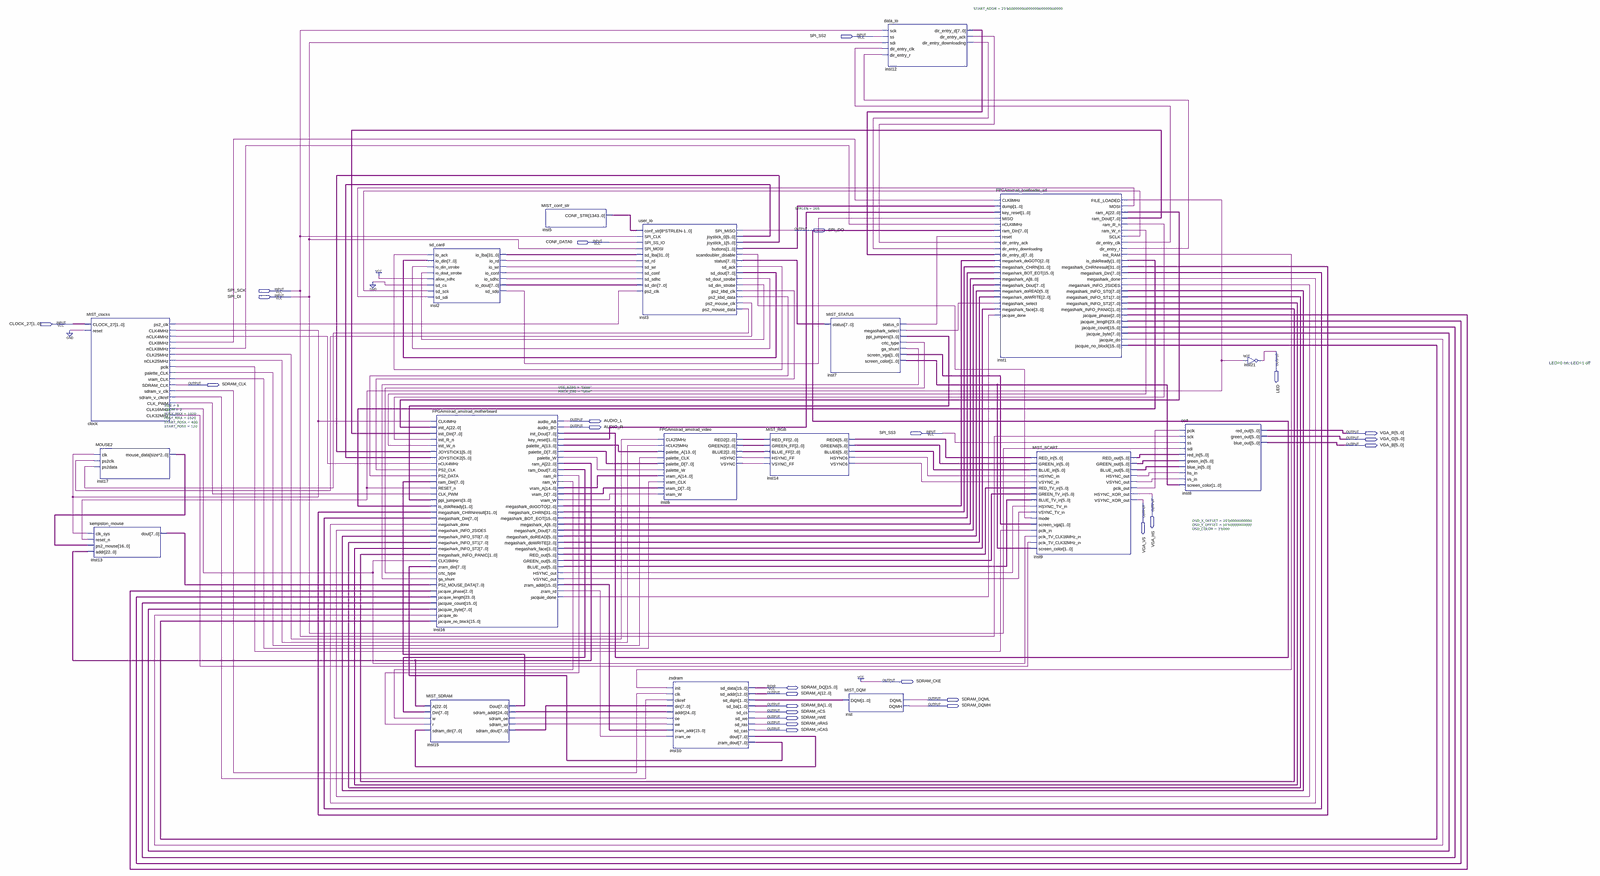
[diagram p0: schematic sheet, whole]
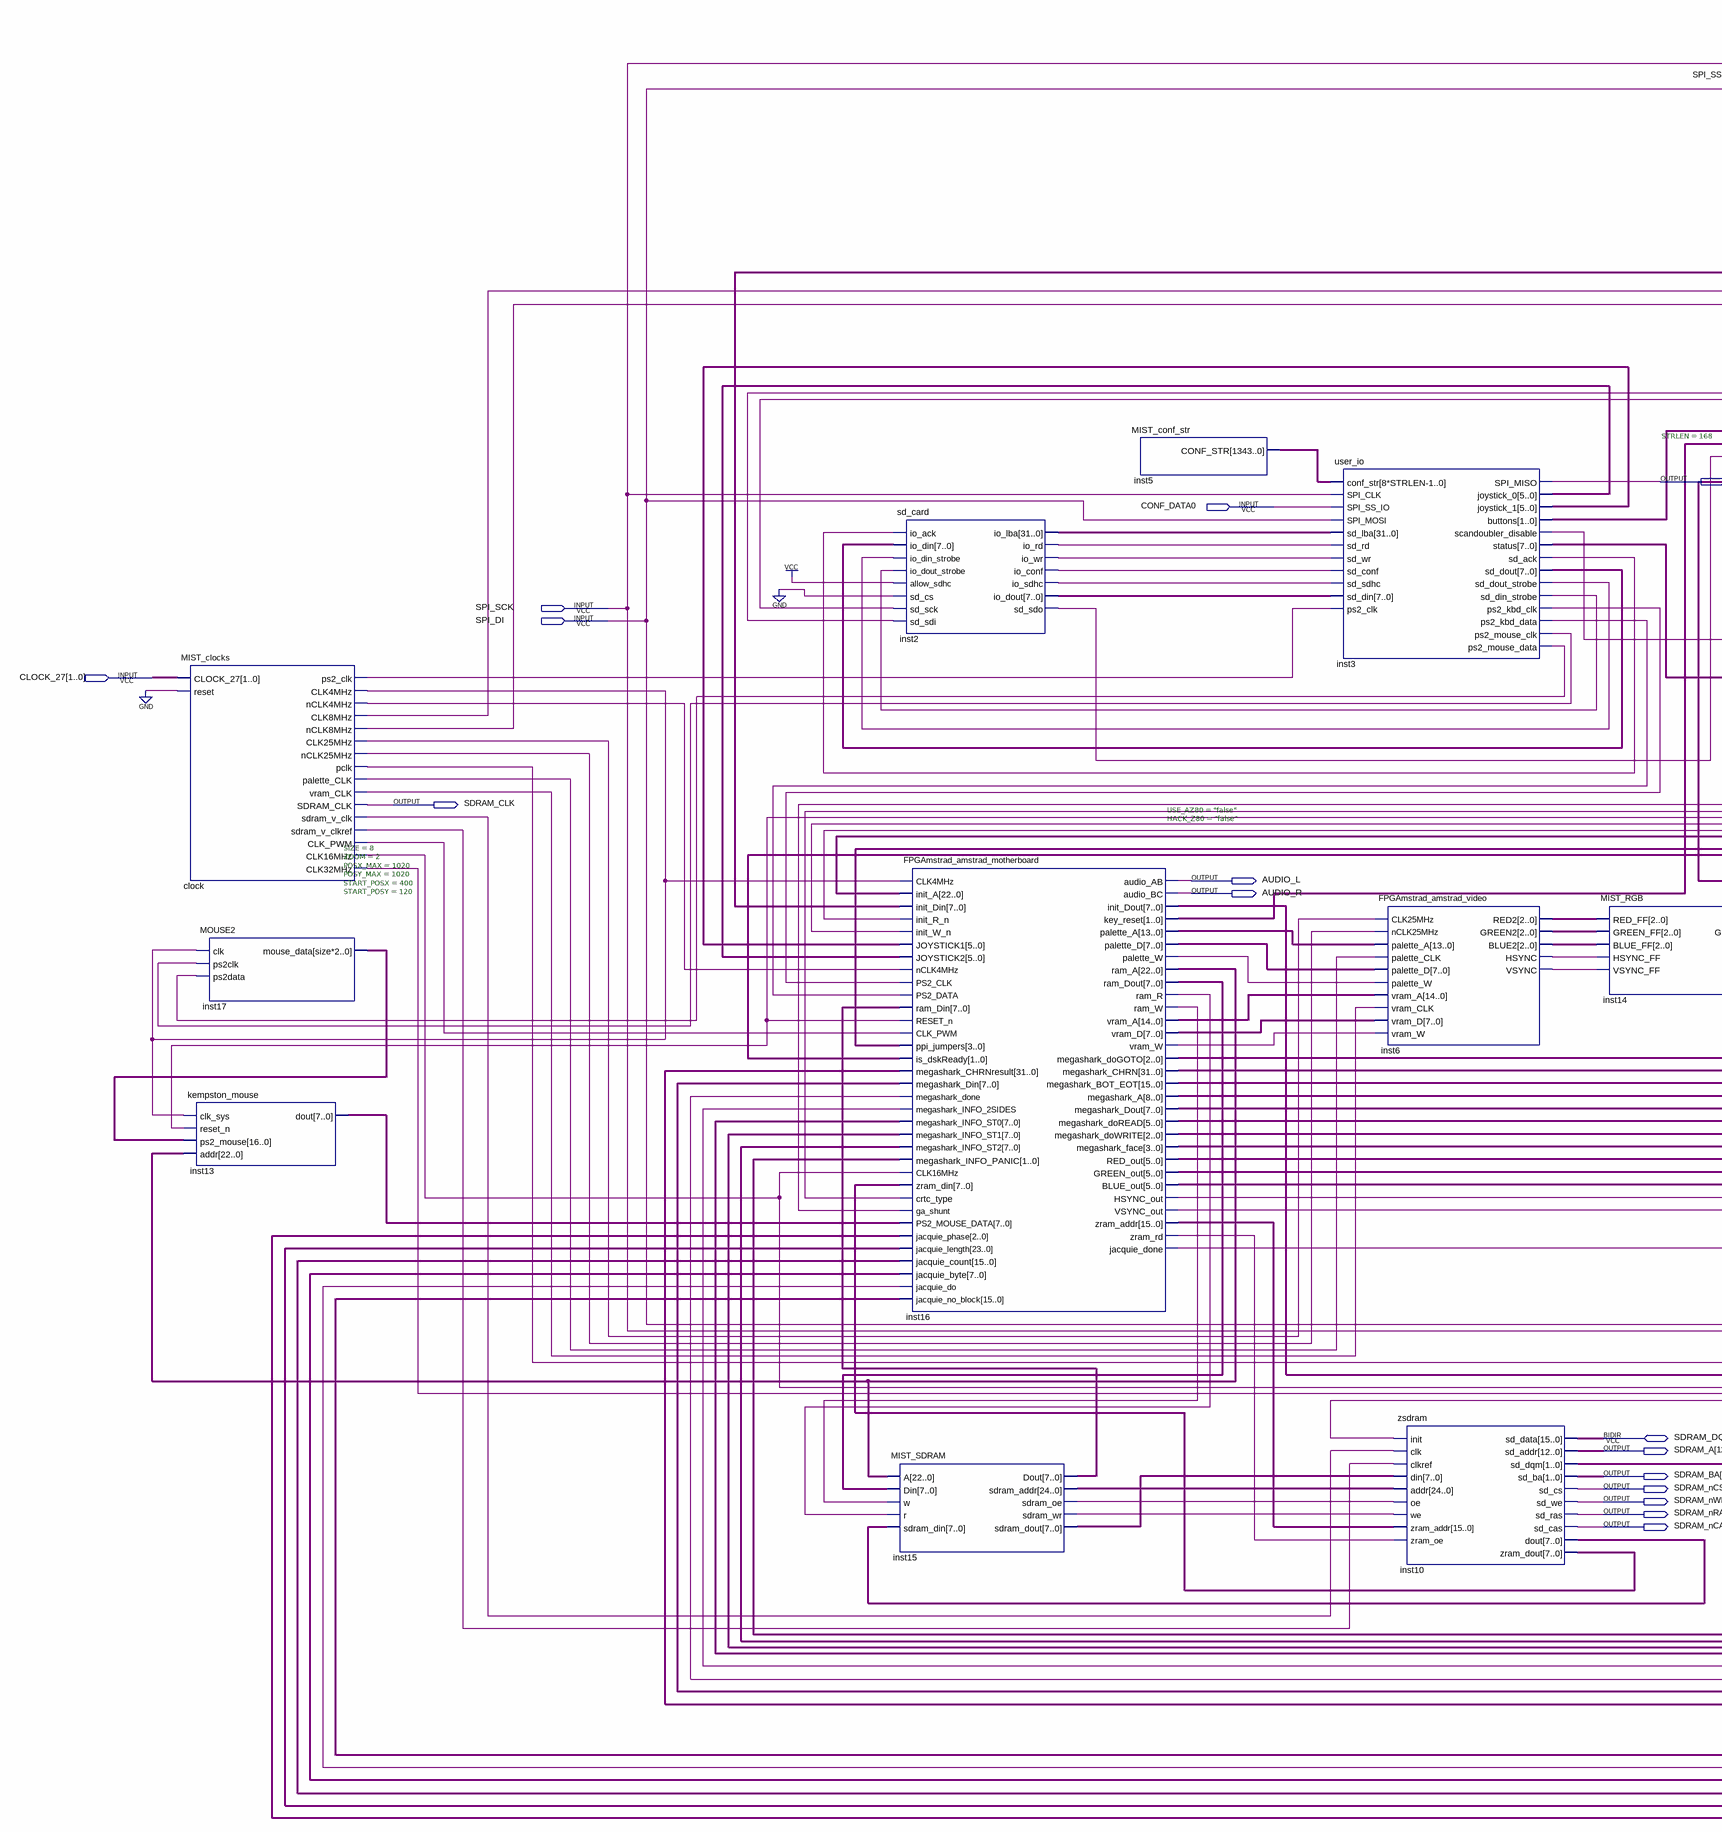
[diagram p1: schematic sheet, left part]
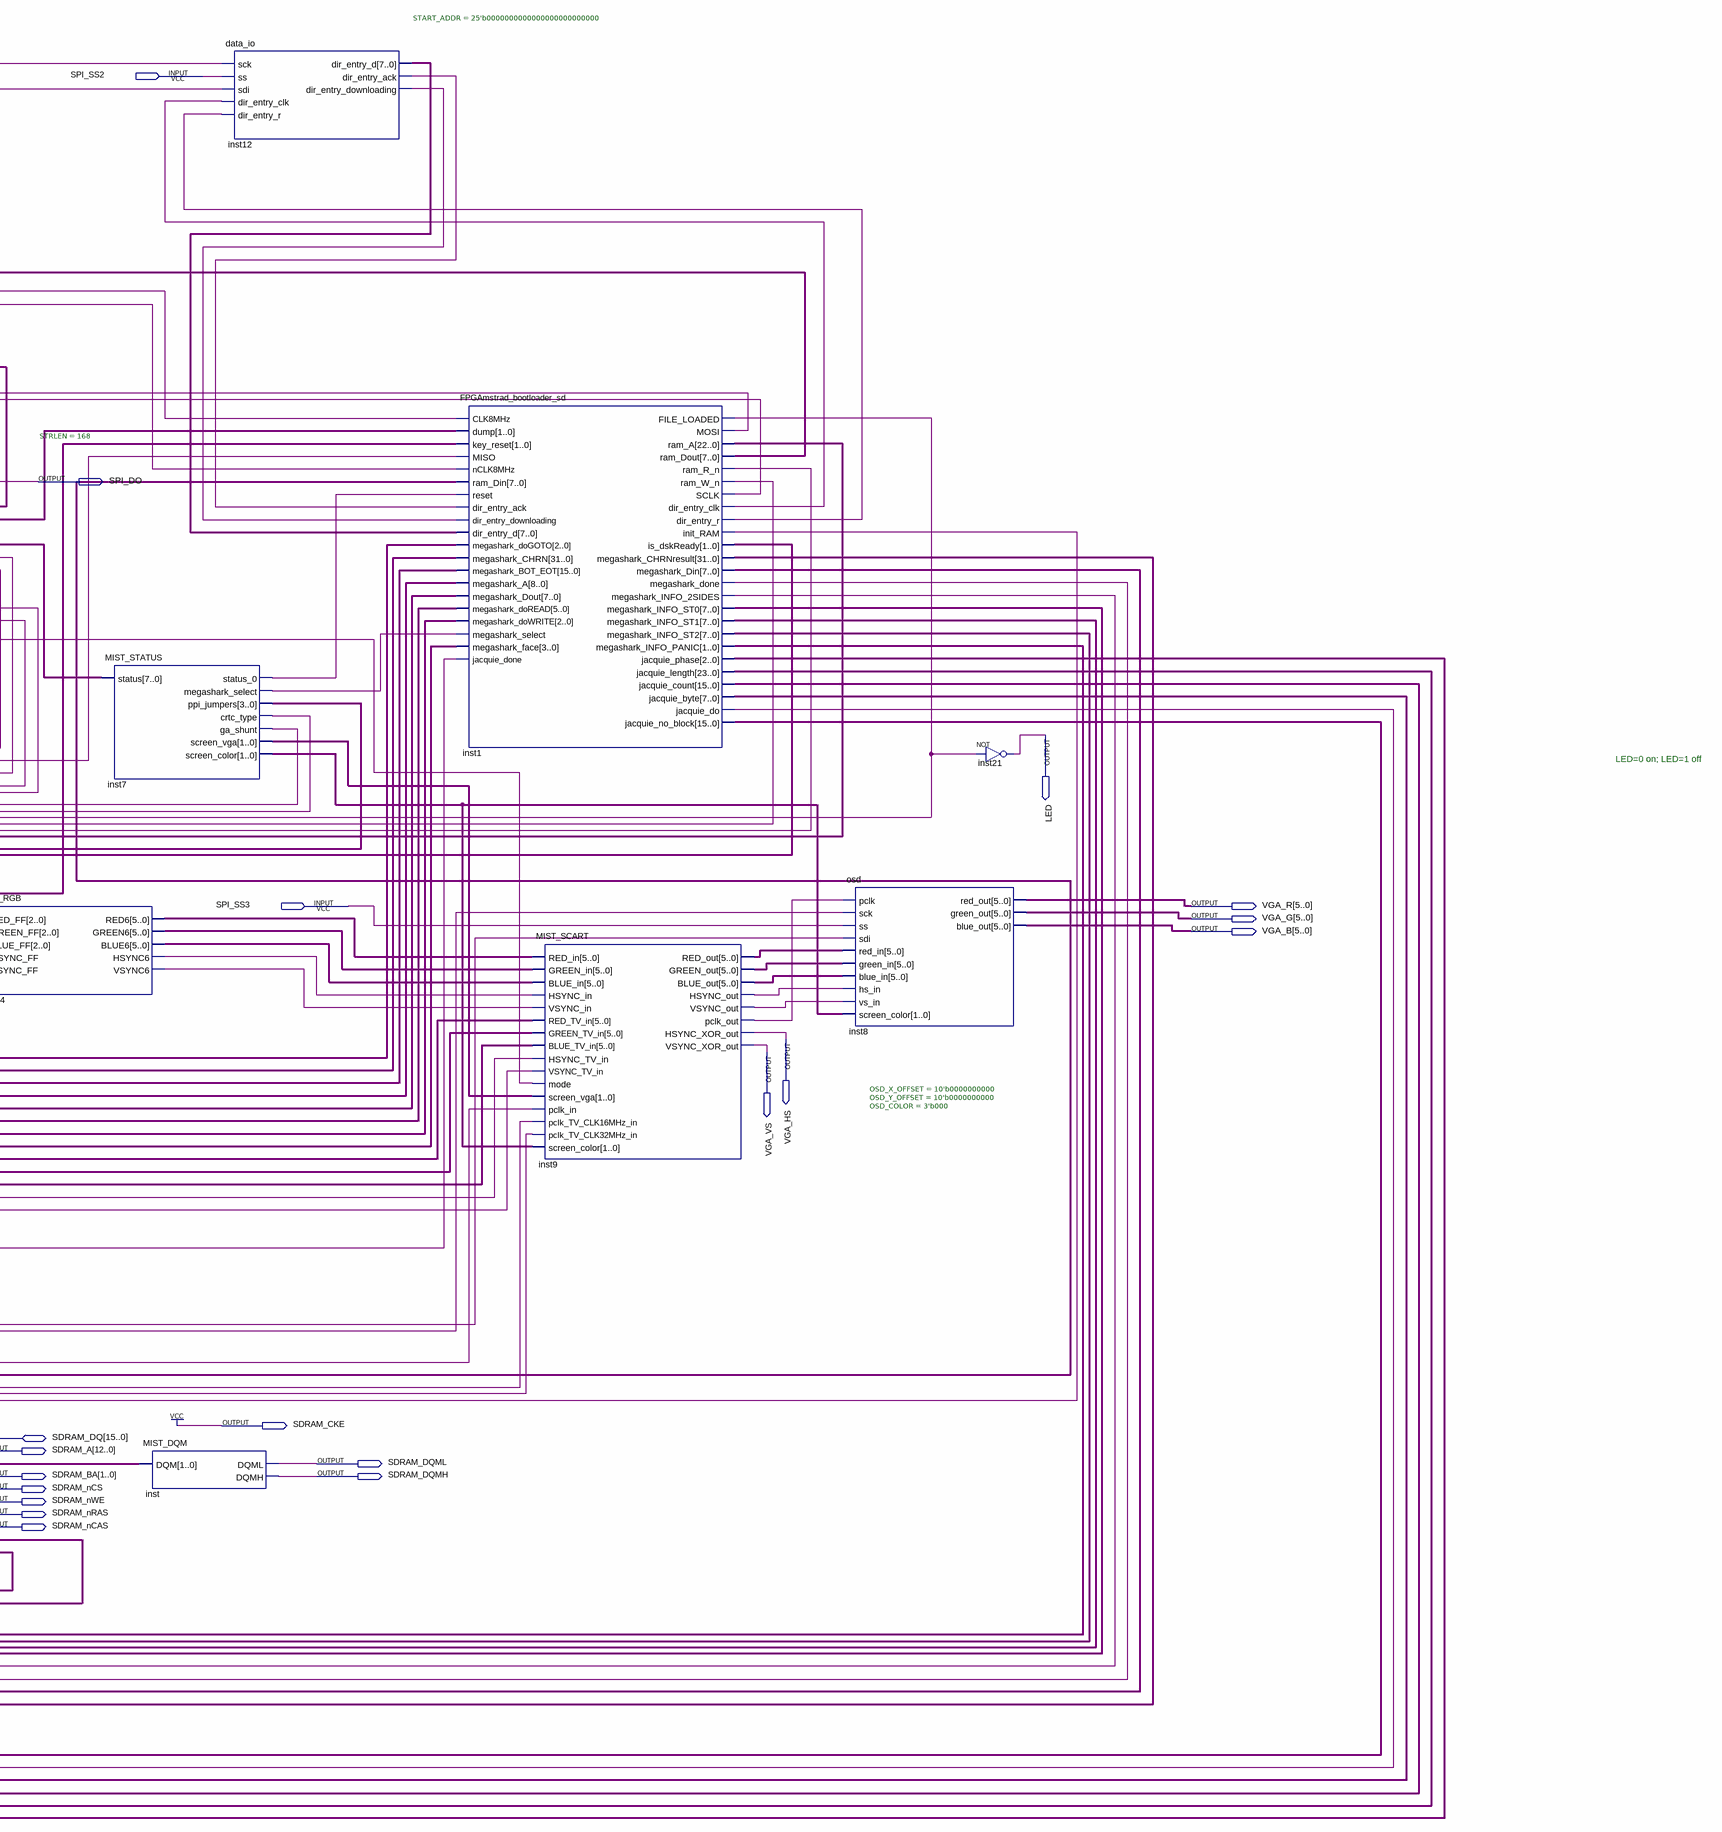
[diagram p2: schematic sheet, right part]
// Quartus schematic FGPAmstrad_MiST_top.bdf as structural Verilog: 18 symbols, 26 pins
module FGPAmstrad_MiST_top (
  input  SPI_SS2,
  input  CONF_DATA0,
  input  SPI_SCK,
  input  SPI_DI,
  input  [1:0] CLOCK_27,
  input  SPI_SS3,
  inout  [15:0] SDRAM_DQ,
  output SPI_DO,
  output LED,
  output SDRAM_CLK,
  output AUDIO_L,
  output AUDIO_R,
  output [5:0] VGA_R,
  output [5:0] VGA_G,
  output [5:0] VGA_B,
  output VGA_HS,
  output VGA_VS,
  output SDRAM_CKE,
  output [12:0] SDRAM_A,
  output SDRAM_DQML,
  output [1:0] SDRAM_BA,
  output SDRAM_DQMH,
  output SDRAM_nCS,
  output SDRAM_nWE,
  output SDRAM_nRAS,
  output SDRAM_nCAS
);

  wire clock_clk4mhz, clock_clk8mhz, clock_clk16mhz, clock_clk25mhz, clock_clk32mhz, clock_clk_pwm,
       clock_nclk4mhz, clock_nclk8mhz, clock_nclk25mhz, clock_palette_clk, clock_pclk, clock_ps2_clk,
       clock_sdram_v_clk, clock_sdram_v_clkref, clock_vram_clk, inst1_dir_entry_clk, inst1_dir_entry_r,
       inst1_file_loaded, inst1_init_ram, inst1_jacquie_do, inst1_megashark_done,
       inst1_megashark_info_2sides, inst1_mosi, inst1_ram_r_n, inst1_ram_w_n, inst1_sclk, inst2_io_conf,
       inst2_io_rd, inst2_io_sdhc, inst2_io_wr, inst2_sd_sdo, inst3_ps2_kbd_clk, inst3_ps2_kbd_data,
       inst3_ps2_mouse_clk, inst3_ps2_mouse_data, inst3_scandoubler_disable, inst3_sd_ack,
       inst3_sd_din_strobe, inst3_sd_dout_strobe, inst6_hsync, inst6_vsync, inst7_crtc_type, inst7_ga_shunt,
       inst7_megashark_select, inst7_status_0, inst9_hsync_out, inst9_pclk_out, inst9_vsync_out,
       inst12_dir_entry_ack, inst12_dir_entry_downloading, inst14_hsync6, inst14_vsync6, inst15_sdram_oe,
       inst15_sdram_wr, inst16_hsync_out, inst16_jacquie_done, inst16_palette_w, inst16_ram_r, inst16_ram_w,
       inst16_vram_w, inst16_vsync_out, inst16_zram_rd;
  wire [1:0] inst1_is_dskready, inst1_megashark_info_panic, inst3_buttons, inst7_screen_color,
       inst7_screen_vga, inst10_sd_dqm, inst16_key_reset;
  wire [2:0] inst1_jacquie_phase, inst6_blue2, inst6_green2, inst6_red2, inst16_megashark_dogoto,
       inst16_megashark_dowrite;
  wire [3:0] inst7_ppi_jumpers, inst16_megashark_face;
  wire [5:0] inst3_joystick_0, inst3_joystick_1, inst9_blue_out, inst9_green_out, inst9_red_out,
       inst14_blue6, inst14_green6, inst14_red6, inst16_blue_out, inst16_green_out, inst16_megashark_doread,
       inst16_red_out;
  wire [7:0] inst1_jacquie_byte, inst1_megashark_din, inst1_megashark_info_st0, inst1_megashark_info_st1,
       inst1_megashark_info_st2, inst1_ram_dout, inst2_io_dout, inst3_sd_dout, inst3_status, inst10_dout,
       inst10_zram_dout, inst12_dir_entry_d, inst13_dout, inst15_dout, inst15_sdram_dout, inst16_init_dout,
       inst16_megashark_dout, inst16_palette_d, inst16_ram_dout, inst16_vram_d;
  wire [8:0] inst16_megashark_a;
  wire [13:0] inst16_palette_a;
  wire [14:0] inst16_vram_a;
  wire [15:0] inst1_jacquie_count, inst1_jacquie_no_block, inst16_megashark_bot_eot, inst16_zram_addr;
  wire [16:0] inst17_mouse_data;
  wire [22:0] inst1_ram_a, inst16_ram_a;
  wire [23:0] inst1_jacquie_length;
  wire [24:0] inst15_sdram_addr;
  wire [31:0] inst1_megashark_chrnresult, inst2_io_lba, inst16_megashark_chrn;
  wire [1343:0] inst5_conf_str;

  MIST_clocks clock (
    .CLOCK_27(CLOCK_27), .reset(1'b0), .ps2_clk(clock_ps2_clk), .CLK4MHz(clock_clk4mhz),
    .nCLK4MHz(clock_nclk4mhz), .CLK8MHz(clock_clk8mhz), .nCLK8MHz(clock_nclk8mhz), .CLK25MHz(clock_clk25mhz),
    .nCLK25MHz(clock_nclk25mhz), .pclk(clock_pclk), .palette_CLK(clock_palette_clk),
    .vram_CLK(clock_vram_clk), .SDRAM_CLK(SDRAM_CLK), .sdram_v_clk(clock_sdram_v_clk),
    .sdram_v_clkref(clock_sdram_v_clkref), .CLK_PWM(clock_clk_pwm), .CLK16MHz(clock_clk16mhz),
    .CLK32MHz(clock_clk32mhz));
  MOUSE2 #(.SIZE(8), .ZOOM(2), .POSX_MAX(1020), .POSY_MAX(1020), .START_POSX(400), .START_POSY(120)) inst17 (
    .clk(clock_clk4mhz), .ps2clk(inst3_ps2_mouse_clk), .ps2data(inst3_ps2_mouse_data),
    .mouse_data(inst17_mouse_data));
  kempston_mouse inst13 (
    .clk_sys(clock_clk4mhz), .reset_n(inst1_file_loaded), .ps2_mouse(inst17_mouse_data), .addr(inst16_ram_a),
    .dout(inst13_dout));
  sd_card inst2 (
    .io_ack(inst3_sd_ack), .io_din(inst3_sd_dout), .io_din_strobe(inst3_sd_dout_strobe),
    .io_dout_strobe(inst3_sd_din_strobe), .allow_sdhc(1'b1), .sd_cs(1'b0), .sd_sck(inst1_sclk),
    .sd_sdi(inst1_mosi), .io_lba(inst2_io_lba), .io_rd(inst2_io_rd), .io_wr(inst2_io_wr),
    .io_conf(inst2_io_conf), .io_sdhc(inst2_io_sdhc), .io_dout(inst2_io_dout), .sd_sdo(inst2_sd_sdo));
  FPGAmstrad_amstrad_motherboard #(.USE_AZ80("false"), .HACK_Z80("false")) inst16 (
    .CLK4MHz(clock_clk4mhz), .init_A(inst1_ram_a), .init_Din(inst1_ram_dout), .init_R_n(inst1_ram_r_n),
    .init_W_n(inst1_ram_w_n), .JOYSTICK1(inst3_joystick_1), .JOYSTICK2(inst3_joystick_0),
    .nCLK4MHz(clock_nclk4mhz), .PS2_CLK(inst3_ps2_kbd_clk), .PS2_DATA(inst3_ps2_kbd_data),
    .ram_Din(inst15_dout), .RESET_n(inst1_file_loaded), .CLK_PWM(clock_clk_pwm),
    .ppi_jumpers(inst7_ppi_jumpers), .is_dskReady(inst1_is_dskready),
    .megashark_CHRNresult(inst1_megashark_chrnresult), .megashark_Din(inst1_megashark_din),
    .megashark_done(inst1_megashark_done), .megashark_INFO_2SIDES(inst1_megashark_info_2sides),
    .megashark_INFO_ST0(inst1_megashark_info_st0), .megashark_INFO_ST1(inst1_megashark_info_st1),
    .megashark_INFO_ST2(inst1_megashark_info_st2), .megashark_INFO_PANIC(inst1_megashark_info_panic),
    .CLK16MHz(clock_clk16mhz), .zram_din(inst10_zram_dout), .crtc_type(inst7_crtc_type),
    .ga_shunt(inst7_ga_shunt), .PS2_MOUSE_DATA(inst13_dout), .jacquie_phase(inst1_jacquie_phase),
    .jacquie_length(inst1_jacquie_length), .jacquie_count(inst1_jacquie_count),
    .jacquie_byte(inst1_jacquie_byte), .jacquie_do(inst1_jacquie_do),
    .jacquie_no_block(inst1_jacquie_no_block), .audio_AB(AUDIO_L), .audio_BC(AUDIO_R),
    .init_Dout(inst16_init_dout), .key_reset(inst16_key_reset), .palette_A(inst16_palette_a),
    .palette_D(inst16_palette_d), .palette_W(inst16_palette_w), .ram_A(inst16_ram_a),
    .ram_Dout(inst16_ram_dout), .ram_R(inst16_ram_r), .ram_W(inst16_ram_w), .vram_A(inst16_vram_a),
    .vram_D(inst16_vram_d), .vram_W(inst16_vram_w), .megashark_doGOTO(inst16_megashark_dogoto),
    .megashark_CHRN(inst16_megashark_chrn), .megashark_BOT_EOT(inst16_megashark_bot_eot),
    .megashark_A(inst16_megashark_a), .megashark_Dout(inst16_megashark_dout),
    .megashark_doREAD(inst16_megashark_doread), .megashark_doWRITE(inst16_megashark_dowrite),
    .megashark_face(inst16_megashark_face), .RED_out(inst16_red_out), .GREEN_out(inst16_green_out),
    .BLUE_out(inst16_blue_out), .HSYNC_out(inst16_hsync_out), .VSYNC_out(inst16_vsync_out),
    .zram_addr(inst16_zram_addr), .zram_rd(inst16_zram_rd), .jacquie_done(inst16_jacquie_done));
  MIST_SDRAM inst15 (
    .A(inst16_ram_a), .Din(inst16_ram_dout), .w(inst16_ram_w), .r(inst16_ram_r), .sdram_din(inst10_dout),
    .Dout(inst15_dout), .sdram_addr(inst15_sdram_addr), .sdram_oe(inst15_sdram_oe),
    .sdram_wr(inst15_sdram_wr), .sdram_dout(inst15_sdram_dout));
  MIST_conf_str inst5 (.CONF_STR(inst5_conf_str));
  user_io #(.STRLEN(168)) inst3 (
    .conf_str(inst5_conf_str), .SPI_CLK(SPI_SCK), .SPI_SS_IO(CONF_DATA0), .SPI_MOSI(SPI_DI),
    .sd_lba(inst2_io_lba), .sd_rd(inst2_io_rd), .sd_wr(inst2_io_wr), .sd_conf(inst2_io_conf),
    .sd_sdhc(inst2_io_sdhc), .sd_din(inst2_io_dout), .ps2_clk(clock_ps2_clk), .SPI_MISO(SPI_DO),
    .joystick_0(inst3_joystick_0), .joystick_1(inst3_joystick_1), .buttons(inst3_buttons),
    .scandoubler_disable(inst3_scandoubler_disable), .status(inst3_status), .sd_ack(inst3_sd_ack),
    .sd_dout(inst3_sd_dout), .sd_dout_strobe(inst3_sd_dout_strobe), .sd_din_strobe(inst3_sd_din_strobe),
    .ps2_kbd_clk(inst3_ps2_kbd_clk), .ps2_kbd_data(inst3_ps2_kbd_data), .ps2_mouse_clk(inst3_ps2_mouse_clk),
    .ps2_mouse_data(inst3_ps2_mouse_data));
  FPGAmstrad_amstrad_video inst6 (
    .CLK25MHz(clock_clk25mhz), .nCLK25MHz(clock_nclk25mhz), .palette_A(inst16_palette_a),
    .palette_CLK(clock_palette_clk), .palette_D(inst16_palette_d), .palette_W(inst16_palette_w),
    .vram_A(inst16_vram_a), .vram_CLK(clock_vram_clk), .vram_D(inst16_vram_d), .vram_W(inst16_vram_w),
    .RED2(inst6_red2), .GREEN2(inst6_green2), .BLUE2(inst6_blue2), .HSYNC(inst6_hsync), .VSYNC(inst6_vsync));
  zsdram inst10 (
    .init(inst1_init_ram), .clk(clock_sdram_v_clk), .clkref(clock_sdram_v_clkref), .din(inst15_sdram_dout),
    .addr(inst15_sdram_addr), .oe(inst15_sdram_oe), .we(inst15_sdram_wr), .zram_addr(inst16_zram_addr),
    .zram_oe(inst16_zram_rd), .sd_addr(SDRAM_A), .sd_dqm(inst10_sd_dqm), .sd_ba(SDRAM_BA), .sd_cs(SDRAM_nCS),
    .sd_we(SDRAM_nWE), .sd_ras(SDRAM_nRAS), .sd_cas(SDRAM_nCAS), .dout(inst10_dout),
    .zram_dout(inst10_zram_dout), .sd_data(SDRAM_DQ));
  MIST_RGB inst14 (
    .RED_FF(inst6_red2), .GREEN_FF(inst6_green2), .BLUE_FF(inst6_blue2), .HSYNC_FF(inst6_hsync),
    .VSYNC_FF(inst6_vsync), .RED6(inst14_red6), .GREEN6(inst14_green6), .BLUE6(inst14_blue6),
    .HSYNC6(inst14_hsync6), .VSYNC6(inst14_vsync6));
  MIST_STATUS inst7 (
    .status(inst3_status), .status_0(inst7_status_0), .megashark_select(inst7_megashark_select),
    .ppi_jumpers(inst7_ppi_jumpers), .crtc_type(inst7_crtc_type), .ga_shunt(inst7_ga_shunt),
    .screen_vga(inst7_screen_vga), .screen_color(inst7_screen_color));
  MIST_DQM inst (.DQM(inst10_sd_dqm), .DQML(SDRAM_DQML), .DQMH(SDRAM_DQMH));
  data_io #(.START_ADDR(25'b0000000000000000000000000)) inst12 (
    .sck(SPI_SCK), .ss(SPI_SS2), .sdi(SPI_DI), .dir_entry_clk(inst1_dir_entry_clk),
    .dir_entry_r(inst1_dir_entry_r), .dir_entry_d(inst12_dir_entry_d), .dir_entry_ack(inst12_dir_entry_ack),
    .dir_entry_downloading(inst12_dir_entry_downloading));
  FPGAmstrad_bootloader_sd inst1 (
    .CLK8MHz(clock_clk8mhz), .dump(inst3_buttons), .key_reset(inst16_key_reset), .MISO(inst2_sd_sdo),
    .nCLK8MHz(clock_nclk8mhz), .ram_Din(inst16_init_dout), .reset(inst7_status_0),
    .dir_entry_ack(inst12_dir_entry_ack), .dir_entry_downloading(inst12_dir_entry_downloading),
    .dir_entry_d(inst12_dir_entry_d), .megashark_doGOTO(inst16_megashark_dogoto),
    .megashark_CHRN(inst16_megashark_chrn), .megashark_BOT_EOT(inst16_megashark_bot_eot),
    .megashark_A(inst16_megashark_a), .megashark_Dout(inst16_megashark_dout),
    .megashark_doREAD(inst16_megashark_doread), .megashark_doWRITE(inst16_megashark_dowrite),
    .megashark_select(inst7_megashark_select), .megashark_face(inst16_megashark_face),
    .jacquie_done(inst16_jacquie_done), .FILE_LOADED(inst1_file_loaded), .MOSI(inst1_mosi),
    .ram_A(inst1_ram_a), .ram_Dout(inst1_ram_dout), .ram_R_n(inst1_ram_r_n), .ram_W_n(inst1_ram_w_n),
    .SCLK(inst1_sclk), .dir_entry_clk(inst1_dir_entry_clk), .dir_entry_r(inst1_dir_entry_r),
    .init_RAM(inst1_init_ram), .is_dskReady(inst1_is_dskready),
    .megashark_CHRNresult(inst1_megashark_chrnresult), .megashark_Din(inst1_megashark_din),
    .megashark_done(inst1_megashark_done), .megashark_INFO_2SIDES(inst1_megashark_info_2sides),
    .megashark_INFO_ST0(inst1_megashark_info_st0), .megashark_INFO_ST1(inst1_megashark_info_st1),
    .megashark_INFO_ST2(inst1_megashark_info_st2), .megashark_INFO_PANIC(inst1_megashark_info_panic),
    .jacquie_phase(inst1_jacquie_phase), .jacquie_length(inst1_jacquie_length),
    .jacquie_count(inst1_jacquie_count), .jacquie_byte(inst1_jacquie_byte), .jacquie_do(inst1_jacquie_do),
    .jacquie_no_block(inst1_jacquie_no_block));
  MIST_SCART inst9 (
    .RED_in(inst14_red6), .GREEN_in(inst14_green6), .BLUE_in(inst14_blue6), .HSYNC_in(inst14_hsync6),
    .VSYNC_in(inst14_vsync6), .RED_TV_in(inst16_red_out), .GREEN_TV_in(inst16_green_out),
    .BLUE_TV_in(inst16_blue_out), .HSYNC_TV_in(inst16_hsync_out), .VSYNC_TV_in(inst16_vsync_out),
    .mode(inst3_scandoubler_disable), .screen_vga(inst7_screen_vga), .pclk_in(clock_pclk),
    .pclk_TV_CLK16MHz_in(clock_clk16mhz), .pclk_TV_CLK32MHz_in(clock_clk32mhz),
    .screen_color(inst7_screen_color), .RED_out(inst9_red_out), .GREEN_out(inst9_green_out),
    .BLUE_out(inst9_blue_out), .HSYNC_out(inst9_hsync_out), .VSYNC_out(inst9_vsync_out),
    .pclk_out(inst9_pclk_out), .HSYNC_XOR_out(VGA_HS), .VSYNC_XOR_out(VGA_VS));
  osd #(.OSD_X_OFFSET(10'b0000000000), .OSD_Y_OFFSET(10'b0000000000), .OSD_COLOR(3'b000)) inst8 (
    .pclk(inst9_pclk_out), .sck(SPI_SCK), .ss(SPI_SS3), .sdi(SPI_DI), .red_in(inst9_red_out),
    .green_in(inst9_green_out), .blue_in(inst9_blue_out), .hs_in(inst9_hsync_out), .vs_in(inst9_vsync_out),
    .screen_color(inst7_screen_color), .red_out(VGA_R), .green_out(VGA_G), .blue_out(VGA_B));
  not inst21 (LED, inst1_file_loaded);

  assign SDRAM_CKE = 1'b1;

  // Notes on the sheet:
  //   LED=0 on; LED=1 off
endmodule
